# Altium schematic sheet S1.SchDoc
size A4
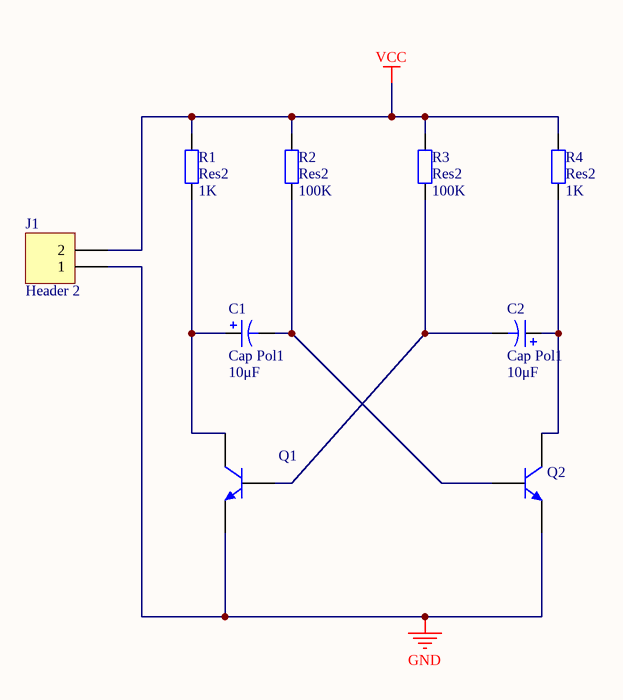
[diagram p0: S1.SchDoc]

## Parts
C1  Cap Pol1  value 10μF  [RB7.6-15]
C2  Cap Pol1  value 10μF  [RB7.6-15]
J1  Header 2  [HDR1X2]
Q1  2N3904  [BCY-W3/E4]  (value not drawn)
Q2  2N3904  [BCY-W3/E4]  (value not drawn)
R1  Res2  value 1K  [AXIAL-0.4]
R2  Res2  value 100K  [AXIAL-0.4]
R3  Res2  value 100K  [AXIAL-0.4]
R4  Res2  value 1K  [AXIAL-0.4]

## Nets
GND: J1.1 Q1.1(E) Q2.1(E)
VCC: J1.2 R1.2 R2.2 R3.2 R4.2
NetC1_1: C1.1 Q1.3(C) R1.1
NetC1_2: C1.2 Q2.2(B) R2.1
NetC2_1: C2.1 Q2.3(C) R4.1
NetC2_2: C2.2 Q1.2(B) R3.1

## Library data of the parts
C1 C2 = Cap Pol1: Polarized Capacitor (Radial); Published: 8-Jun-2000; LatestRevisionDate: 17-Jul-2002; LatestRevisionNote: Re-released for DXP Platform.; PackageReference: RB7.6-15; Publisher: Altium Limited
J1 = Header 2: Header, 2-Pin; LatestRevisionDate: 17-Jul-2002; LatestRevisionNote: Re-released for DXP Platform.; Publisher: Altium Limited
Q1 Q2 = 2N3904: NPN General Purpose Amplifier; Published: 8-Jun-2000; LatestRevisionDate: 15-Jan-2003; LatestRevisionNote: PCB Footprint 'BCY-W3/D4.7' replaced; DatasheetVersion: 1997; PackageVersion: Sep-1998; PackageReference: TO-92A; Publisher: Altium Limited; Code_JEDEC: TO-92A; ComponentLink1Description: Manufacturer Link; ComponentLink1URL: http://www.fairchildsemi.com/; ComponentLink2Description: Datasheet; ComponentLink2URL: http://www.fairchildsemi.com/ds/2N%2F2N3904.pdf
R1-R4 = Res2: Resistor; Published: 8-Jun-2000; LatestRevisionDate: 17-Jul-2002; LatestRevisionNote: Re-released for DXP Platform.; PackageReference: AXIAL-0.4; Publisher: Altium Limited